# Altium schematic sheet WL-BPF.SchDoc
size 594 x 420 mm; Scale: 1:1; DocumentType: Схема электрическая принципиальная; FirstReferrence: UA3REO/R7KBI; ListNumber: 2; DocumentNumber: 10; SheetNumber: 11; SheetTotal: 12
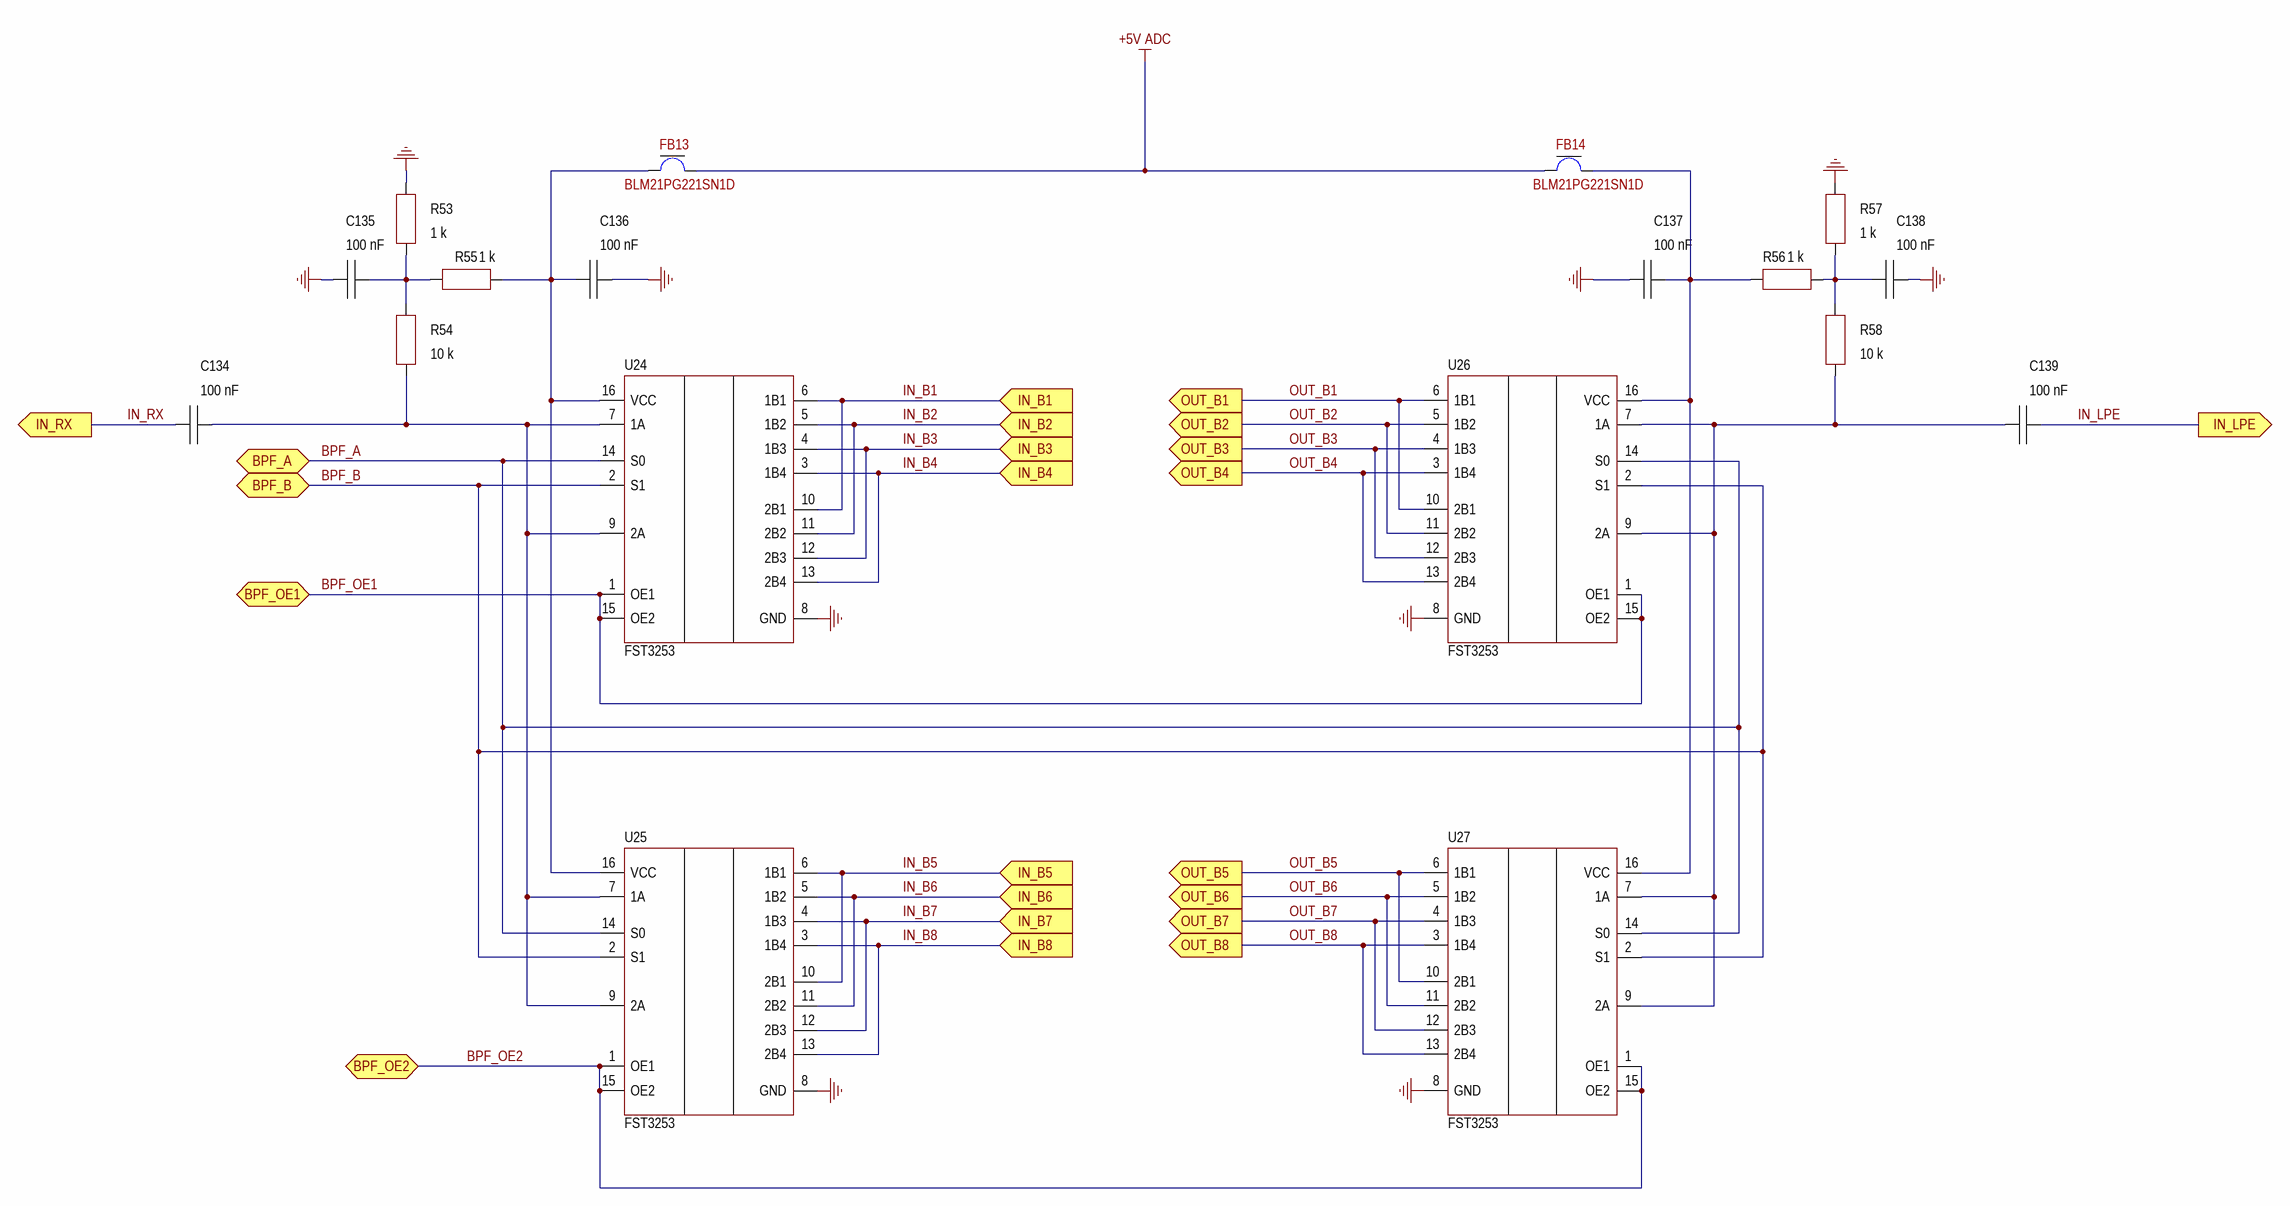
[diagram p0: WL-BPF.SchDoc]

## Parts
C134  100 nF  [C-0805-0.95]
C135  100 nF  [C-0805-0.95]
C136  100 nF  [C-0805-0.95]
C137  100 nF  [C-0805-0.95]
C138  100 nF  [C-0805-0.95]
C139  100 nF  [C-0805-0.95]
FB13  BLM21PG221SN1D  [L-0805]
FB14  BLM21PG221SN1D  [L-0805]
R53  1 k  [R-0805]
R54  10 k  [R-0805]
R55  1 k  [R-0805]
R56  1 k  [R-0805]
R57  1 k  [R-0805]
R58  10 k  [R-0805]
U24  FST3253  [SSOP-16]
U25  FST3253  [SSOP-16]
U26  FST3253  [SSOP-16]
U27  FST3253  [SSOP-16]

## Ports
BPF_A (bidir), BPF_B (bidir), BPF_OE1 (bidir), BPF_OE2 (bidir), IN_B1 (in), IN_B2 (in), IN_B3 (in), IN_B4 (in), IN_B5 (in), IN_B6 (in), IN_B7 (in), IN_B8 (in), IN_LPE (out), IN_RX (out), OUT_B1 (out), OUT_B2 (out), OUT_B3 (out), OUT_B4 (out), OUT_B5 (out), OUT_B6 (out), OUT_B7 (out), OUT_B8 (out)

## Nets
+5V ADC: FB13.2 FB14.2
GND: C135.1 C136.2 C137.2 C138.1 R53.1 R57.1 U24.8(GND) U25.8(GND) U26.8(GND) U27.8(GND)
BPF_A: U24.14(S0) U25.14(S0) U26.14(S0) U27.14(S0) ; port BPF_A
BPF_B: U24.2(S1) U25.2(S1) U26.2(S1) U27.2(S1) ; port BPF_B
BPF_OE1: U24.1(OE1) U24.15(OE2) U26.1(OE1) U26.15(OE2) ; port BPF_OE1
BPF_OE2: U25.1(OE1) U25.15(OE2) U27.1(OE1) U27.15(OE2) ; port BPF_OE2
IN_B1: U24.6(1B1) U24.10(2B1) ; port IN_B1
IN_B2: U24.5(1B2) U24.11(2B2) ; port IN_B2
IN_B3: U24.4(1B3) U24.12(2B3) ; port IN_B3
IN_B4: U24.3(1B4) U24.13(2B4) ; port IN_B4
IN_B5: U25.6(1B1) U25.10(2B1) ; port IN_B5
IN_B6: U25.5(1B2) U25.11(2B2) ; port IN_B6
IN_B7: U25.4(1B3) U25.12(2B3) ; port IN_B7
IN_B8: U25.3(1B4) U25.13(2B4) ; port IN_B8
IN_LPE: C139.1 ; port IN_LPE
IN_RX: C134.1 ; port IN_RX
OUT_B1: U26.6(1B1) U26.10(2B1) ; port OUT_B1
OUT_B2: U26.5(1B2) U26.11(2B2) ; port OUT_B2
OUT_B3: U26.4(1B3) U26.12(2B3) ; port OUT_B3
OUT_B4: U26.3(1B4) U26.13(2B4) ; port OUT_B4
OUT_B5: U27.6(1B1) U27.10(2B1) ; port OUT_B5
OUT_B6: U27.5(1B2) U27.11(2B2) ; port OUT_B6
OUT_B7: U27.4(1B3) U27.12(2B3) ; port OUT_B7
OUT_B8: U27.3(1B4) U27.13(2B4) ; port OUT_B8
NetC134_2: C134.2 R54.1 U24.7(1A) U24.9(2A) U25.7(1A) U25.9(2A)
NetC135_2: C135.2 R53.2 R54.2 R55.2
NetC136_1: C136.1 FB13.1 R55.1 U24.16(VCC) U25.16(VCC)
NetC137_1: C137.1 FB14.1 R56.1 U26.16(VCC) U27.16(VCC)
NetC138_2: C138.2 R56.2 R57.2 R58.2
NetC139_2: C139.2 R58.1 U26.7(1A) U26.9(2A) U27.7(1A) U27.9(2A)

## Notes on the sheet
- Подп. дата
- Инв. № дубл.
- Взам. инв. №
- Подп. и дата
- Инв. № подл.
- Изм.
- Лист
- № докум.
- Подп.
- Дата
- ALTIUM GOSTBOM2.0 KEV
- Файл:
- Копировал
- Формат А2

## Library data of the parts
C134-C139 = CC0805KRX7R9BB104: Manufacturer: Yageo; Value: 100; Type: Конденсатор; Dielectric: X7R; Tolerance: ±10%; Voltage: 50 V; CommentDOC: ( CC - 0805 - X7R - 50 V - 100 nF ±10% ); Part Number: CC0805KRX7R9BB104; Units: nF; Case: 0805; Operating Temperature: -55 ... 125 °C; Series: CC; Value+Units: 100 nF; ValueSCH: 100 nF; ( Series - Case - Dielectric -  Voltage - Value+Units Tolerance: ( CC - 0805 - X7R - 50 V - 100 nF ±10% )
FB13 FB14 = BLM21PG221SN1D: Manufacturer: Murata Electronics; Type: Ферритовая бусина; Part Number: BLM21PG221SN1D; Series: EMIFIL; Case: 0805; ValueSCH: BLM21PG221SN1D; Operating Temperature: −55°C ... 125°C
R53 R55-R57 = RC0805JR-071KL: Manufacturer: Yageo; Value: 1; Power: 0,125 W; Units: kOhm; Tolerance: ±5%; Operating Voltage: 150 V; Value+Units: 1 kOhm; CommentDOC: ( RC - 0805 - 0,125 W - 1 kOhm  ±5% ); Type: Резистор; Part Number: RC0805JR-071KL; Case: 0805; Operating Temperature: -55°C ... 155°C; ValueSCH: 1 k; Series: RC
R54 R58 = RC0805JR-0710KL: Manufacturer: Yageo; Value: 10; Power: 0,125 W; Units: kOhm; Tolerance: ±5%; Operating Voltage: 150 V; Value+Units: 10 kOhm; CommentDOC: ( RC - 0805 - 0,125 W - 10 kOhm  ±5% ); Type: Резистор; Part Number: RC0805JR-0710KL; Case: 0805; Operating Temperature: -55°C ... 155°C; ValueSCH: 10 k; Series: RC
U24-U27 = 74FST3253QSR: IC MUX/DEMUX 2 X 4:1; Manufacturer: ON Semiconductor; Voltage  Supply: +4 V … 5,5 V; Part Number: 74FST3253QSR; Function: IC MUX/DEMUX 2 X 4:1; Case: SSOP-16; Operating Temperature: -40 ... 85 °C; Type: Микросхема